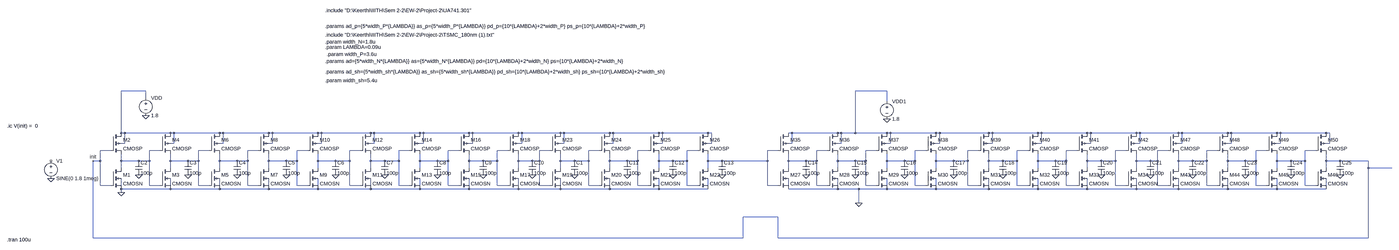
[diagram p0: schematic clock.asc, whole sheet]
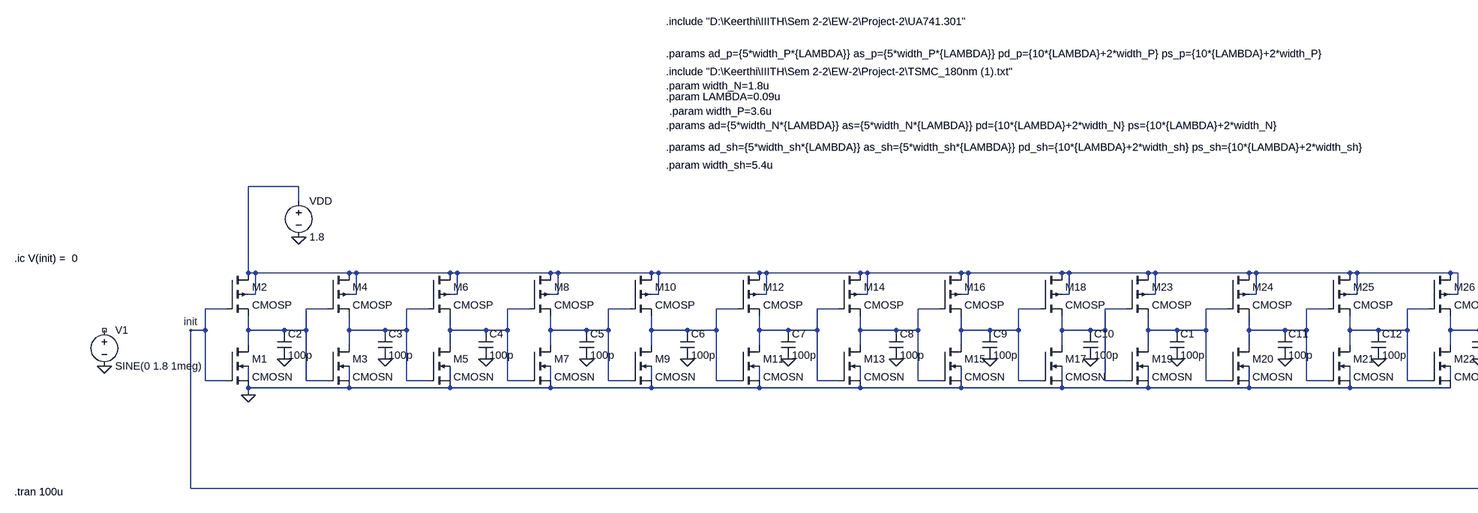
[diagram p1: schematic clock.asc, part, row 1 of 1, column 1 of 2]
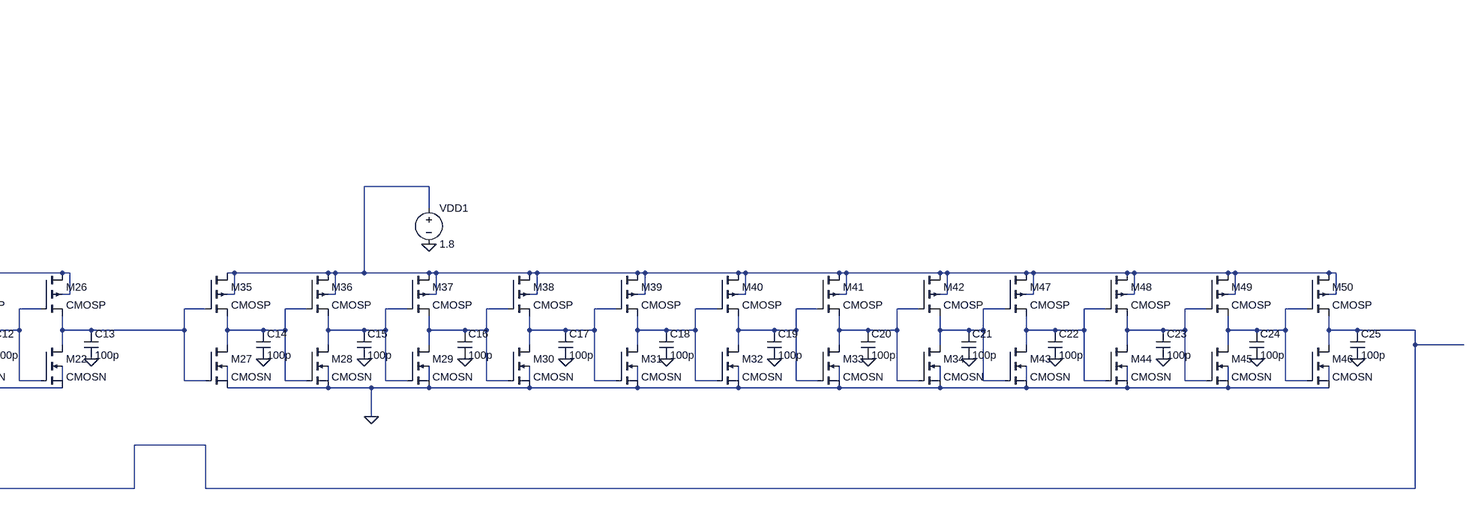
[diagram p2: schematic clock.asc, part, row 1 of 1, column 2 of 2]
clock.asc, the LTspice schematic file:
Version 4.1
SHEET 1 7152 696
WIRE 432 0 320 0
WIRE 3808 0 3664 0
WIRE 432 32 432 0
WIRE 3808 48 3808 0
WIRE 320 192 320 0
WIRE 336 192 320 192
WIRE 544 192 336 192
WIRE 560 192 544 192
WIRE 768 192 560 192
WIRE 784 192 768 192
WIRE 992 192 784 192
WIRE 1008 192 992 192
WIRE 1216 192 1008 192
WIRE 1232 192 1216 192
WIRE 1456 192 1232 192
WIRE 1472 192 1456 192
WIRE 1680 192 1472 192
WIRE 1696 192 1680 192
WIRE 1904 192 1696 192
WIRE 1920 192 1904 192
WIRE 2128 192 1920 192
WIRE 2144 192 2128 192
WIRE 2320 192 2144 192
WIRE 2336 192 2320 192
WIRE 2544 192 2336 192
WIRE 2560 192 2544 192
WIRE 2768 192 2560 192
WIRE 2784 192 2768 192
WIRE 2992 192 2784 192
WIRE 3008 192 2992 192
WIRE 3376 192 3360 192
WIRE 3584 192 3376 192
WIRE 3600 192 3584 192
WIRE 3664 192 3664 0
WIRE 3664 192 3600 192
WIRE 3808 192 3664 192
WIRE 3824 192 3808 192
WIRE 4032 192 3824 192
WIRE 4048 192 4032 192
WIRE 4272 192 4048 192
WIRE 4288 192 4272 192
WIRE 4496 192 4288 192
WIRE 4512 192 4496 192
WIRE 4720 192 4512 192
WIRE 4736 192 4720 192
WIRE 4944 192 4736 192
WIRE 4960 192 4944 192
WIRE 5136 192 4960 192
WIRE 5152 192 5136 192
WIRE 5360 192 5152 192
WIRE 5376 192 5360 192
WIRE 5584 192 5376 192
WIRE 5600 192 5584 192
WIRE 5808 192 5600 192
WIRE 5824 192 5808 192
WIRE 336 240 336 192
WIRE 336 240 320 240
WIRE 560 240 560 192
WIRE 560 240 544 240
WIRE 784 240 784 192
WIRE 784 240 768 240
WIRE 1008 240 1008 192
WIRE 1008 240 992 240
WIRE 1232 240 1232 192
WIRE 1232 240 1216 240
WIRE 1472 240 1472 192
WIRE 1472 240 1456 240
WIRE 1696 240 1696 192
WIRE 1696 240 1680 240
WIRE 1920 240 1920 192
WIRE 1920 240 1904 240
WIRE 2144 240 2144 192
WIRE 2144 240 2128 240
WIRE 2336 240 2336 192
WIRE 2336 240 2320 240
WIRE 2560 240 2560 192
WIRE 2560 240 2544 240
WIRE 2784 240 2784 192
WIRE 2784 240 2768 240
WIRE 3008 240 3008 192
WIRE 3008 240 2992 240
WIRE 3376 240 3376 192
WIRE 3376 240 3360 240
WIRE 3600 240 3600 192
WIRE 3600 240 3584 240
WIRE 3824 240 3824 192
WIRE 3824 240 3808 240
WIRE 4048 240 4048 192
WIRE 4048 240 4032 240
WIRE 4288 240 4288 192
WIRE 4288 240 4272 240
WIRE 4512 240 4512 192
WIRE 4512 240 4496 240
WIRE 4736 240 4736 192
WIRE 4736 240 4720 240
WIRE 4960 240 4960 192
WIRE 4960 240 4944 240
WIRE 5152 240 5152 192
WIRE 5152 240 5136 240
WIRE 5376 240 5376 192
WIRE 5376 240 5360 240
WIRE 5600 240 5600 192
WIRE 5600 240 5584 240
WIRE 5824 240 5824 192
WIRE 5824 240 5808 240
WIRE 272 272 224 272
WIRE 496 272 448 272
WIRE 720 272 672 272
WIRE 944 272 896 272
WIRE 1168 272 1120 272
WIRE 1408 272 1360 272
WIRE 1632 272 1584 272
WIRE 1856 272 1808 272
WIRE 2080 272 2032 272
WIRE 2272 272 2224 272
WIRE 2496 272 2448 272
WIRE 2720 272 2672 272
WIRE 2944 272 2896 272
WIRE 3312 272 3264 272
WIRE 3536 272 3488 272
WIRE 3760 272 3712 272
WIRE 3984 272 3936 272
WIRE 4224 272 4176 272
WIRE 4448 272 4400 272
WIRE 4672 272 4624 272
WIRE 4896 272 4848 272
WIRE 5088 272 5040 272
WIRE 5312 272 5264 272
WIRE 5536 272 5488 272
WIRE 5760 272 5712 272
WIRE 224 320 224 272
WIRE 224 320 192 320
WIRE 320 320 320 288
WIRE 400 320 320 320
WIRE 448 320 448 272
WIRE 448 320 400 320
WIRE 544 320 544 288
WIRE 624 320 544 320
WIRE 672 320 672 272
WIRE 672 320 624 320
WIRE 768 320 768 288
WIRE 848 320 768 320
WIRE 896 320 896 272
WIRE 896 320 848 320
WIRE 992 320 992 288
WIRE 1072 320 992 320
WIRE 1120 320 1120 272
WIRE 1120 320 1072 320
WIRE 1216 320 1216 288
WIRE 1296 320 1216 320
WIRE 1360 320 1360 272
WIRE 1360 320 1296 320
WIRE 1456 320 1456 288
WIRE 1520 320 1456 320
WIRE 1584 320 1584 272
WIRE 1584 320 1520 320
WIRE 1680 320 1680 288
WIRE 1760 320 1680 320
WIRE 1808 320 1808 272
WIRE 1808 320 1760 320
WIRE 1904 320 1904 288
WIRE 1968 320 1904 320
WIRE 2032 320 2032 272
WIRE 2032 320 1968 320
WIRE 2128 320 2128 288
WIRE 2192 320 2128 320
WIRE 2224 320 2224 272
WIRE 2224 320 2192 320
WIRE 2320 320 2320 288
WIRE 2384 320 2320 320
WIRE 2448 320 2448 272
WIRE 2448 320 2384 320
WIRE 2544 320 2544 288
WIRE 2624 320 2544 320
WIRE 2672 320 2672 272
WIRE 2672 320 2624 320
WIRE 2768 320 2768 288
WIRE 2832 320 2768 320
WIRE 2896 320 2896 272
WIRE 2896 320 2832 320
WIRE 2992 320 2992 288
WIRE 3056 320 2992 320
WIRE 3264 320 3264 272
WIRE 3264 320 3056 320
WIRE 3360 320 3360 288
WIRE 3440 320 3360 320
WIRE 3488 320 3488 272
WIRE 3488 320 3440 320
WIRE 3584 320 3584 288
WIRE 3664 320 3584 320
WIRE 3712 320 3712 272
WIRE 3712 320 3664 320
WIRE 3808 320 3808 288
WIRE 3888 320 3808 320
WIRE 3936 320 3936 272
WIRE 3936 320 3888 320
WIRE 4032 320 4032 288
WIRE 4112 320 4032 320
WIRE 4176 320 4176 272
WIRE 4176 320 4112 320
WIRE 4272 320 4272 288
WIRE 4336 320 4272 320
WIRE 4400 320 4400 272
WIRE 4400 320 4336 320
WIRE 4496 320 4496 288
WIRE 4576 320 4496 320
WIRE 4624 320 4624 272
WIRE 4624 320 4576 320
WIRE 4720 320 4720 288
WIRE 4784 320 4720 320
WIRE 4848 320 4848 272
WIRE 4848 320 4784 320
WIRE 4944 320 4944 288
WIRE 5008 320 4944 320
WIRE 5040 320 5040 272
WIRE 5040 320 5008 320
WIRE 5136 320 5136 288
WIRE 5200 320 5136 320
WIRE 5264 320 5264 272
WIRE 5264 320 5200 320
WIRE 5360 320 5360 288
WIRE 5440 320 5360 320
WIRE 5488 320 5488 272
WIRE 5488 320 5440 320
WIRE 5584 320 5584 288
WIRE 5648 320 5584 320
WIRE 5712 320 5712 272
WIRE 5712 320 5648 320
WIRE 5808 320 5808 288
WIRE 5872 320 5808 320
WIRE 6000 320 5872 320
WIRE 320 352 320 320
WIRE 544 352 544 320
WIRE 768 352 768 320
WIRE 992 352 992 320
WIRE 1216 352 1216 320
WIRE 1456 352 1456 320
WIRE 1680 352 1680 320
WIRE 1904 352 1904 320
WIRE 2128 352 2128 320
WIRE 2320 352 2320 320
WIRE 2544 352 2544 320
WIRE 2768 352 2768 320
WIRE 2992 352 2992 320
WIRE 3360 352 3360 320
WIRE 3584 352 3584 320
WIRE 3808 352 3808 320
WIRE 4032 352 4032 320
WIRE 4272 352 4272 320
WIRE 4496 352 4496 320
WIRE 4720 352 4720 320
WIRE 4944 352 4944 320
WIRE 5136 352 5136 320
WIRE 5360 352 5360 320
WIRE 5584 352 5584 320
WIRE 5808 352 5808 320
WIRE 6000 352 6000 320
WIRE 6208 352 6000 352
WIRE 224 432 224 320
WIRE 272 432 224 432
WIRE 320 432 320 400
WIRE 448 432 448 320
WIRE 496 432 448 432
WIRE 544 432 544 400
WIRE 672 432 672 320
WIRE 720 432 672 432
WIRE 768 432 768 400
WIRE 896 432 896 320
WIRE 944 432 896 432
WIRE 992 432 992 400
WIRE 1120 432 1120 320
WIRE 1168 432 1120 432
WIRE 1216 432 1216 400
WIRE 1360 432 1360 320
WIRE 1408 432 1360 432
WIRE 1456 432 1456 400
WIRE 1584 432 1584 320
WIRE 1632 432 1584 432
WIRE 1680 432 1680 400
WIRE 1808 432 1808 320
WIRE 1856 432 1808 432
WIRE 1904 432 1904 400
WIRE 2032 432 2032 320
WIRE 2080 432 2032 432
WIRE 2128 432 2128 400
WIRE 2224 432 2224 320
WIRE 2272 432 2224 432
WIRE 2320 432 2320 400
WIRE 2448 432 2448 320
WIRE 2496 432 2448 432
WIRE 2544 432 2544 400
WIRE 2672 432 2672 320
WIRE 2720 432 2672 432
WIRE 2768 432 2768 400
WIRE 2896 432 2896 320
WIRE 2944 432 2896 432
WIRE 2992 432 2992 400
WIRE 3264 432 3264 320
WIRE 3312 432 3264 432
WIRE 3360 432 3360 400
WIRE 3488 432 3488 320
WIRE 3536 432 3488 432
WIRE 3584 432 3584 400
WIRE 3712 432 3712 320
WIRE 3760 432 3712 432
WIRE 3808 432 3808 400
WIRE 3936 432 3936 320
WIRE 3984 432 3936 432
WIRE 4032 432 4032 400
WIRE 4176 432 4176 320
WIRE 4224 432 4176 432
WIRE 4272 432 4272 400
WIRE 4400 432 4400 320
WIRE 4448 432 4400 432
WIRE 4496 432 4496 400
WIRE 4624 432 4624 320
WIRE 4672 432 4624 432
WIRE 4720 432 4720 400
WIRE 4848 432 4848 320
WIRE 4896 432 4848 432
WIRE 4944 432 4944 400
WIRE 5040 432 5040 320
WIRE 5088 432 5040 432
WIRE 5136 432 5136 400
WIRE 5264 432 5264 320
WIRE 5312 432 5264 432
WIRE 5360 432 5360 400
WIRE 5488 432 5488 320
WIRE 5536 432 5488 432
WIRE 5584 432 5584 400
WIRE 5712 432 5712 320
WIRE 5760 432 5712 432
WIRE 5808 432 5808 400
WIRE 544 448 320 448
WIRE 768 448 544 448
WIRE 992 448 768 448
WIRE 1216 448 992 448
WIRE 1456 448 1216 448
WIRE 1680 448 1456 448
WIRE 1904 448 1680 448
WIRE 2128 448 1904 448
WIRE 2320 448 2128 448
WIRE 2544 448 2320 448
WIRE 2768 448 2544 448
WIRE 2992 448 2768 448
WIRE 3584 448 3360 448
WIRE 3680 448 3584 448
WIRE 3808 448 3680 448
WIRE 4032 448 3808 448
WIRE 4272 448 4032 448
WIRE 4496 448 4272 448
WIRE 4720 448 4496 448
WIRE 4944 448 4720 448
WIRE 5136 448 4944 448
WIRE 5360 448 5136 448
WIRE 5584 448 5360 448
WIRE 5808 448 5584 448
WIRE 320 464 320 448
WIRE 3680 512 3680 448
WIRE 3312 576 3152 576
WIRE 192 672 192 320
WIRE 3152 672 3152 576
WIRE 3152 672 192 672
WIRE 3312 672 3312 576
WIRE 6000 672 6000 352
WIRE 6000 672 3312 672
FLAG 432 112 0
FLAG 0 400 0
FLAG 192 320 init
FLAG 320 464 0
FLAG 2192 384 0
FLAG 1968 384 0
FLAG 1760 384 0
FLAG 1520 384 0
FLAG 1296 384 0
FLAG 1072 384 0
FLAG 848 384 0
FLAG 624 384 0
FLAG 400 384 0
FLAG 3056 384 0
FLAG 2832 384 0
FLAG 2624 384 0
FLAG 2384 384 0
FLAG 5008 384 0
FLAG 4784 384 0
FLAG 4576 384 0
FLAG 4336 384 0
FLAG 4112 384 0
FLAG 3888 384 0
FLAG 3664 384 0
FLAG 3440 384 0
FLAG 5872 384 0
FLAG 5648 384 0
FLAG 5440 384 0
FLAG 5200 384 0
FLAG 3808 128 0
FLAG 3680 512 0
SYMBOL nmos4 272 352 R0
SYMATTR InstName M1
SYMATTR Value CMOSN
SYMATTR Value2 l={2*LAMBDA} w={width_N} ad={ad} as={as} pd={pd} ps={ps}
SYMBOL pmos4 272 192 R0
SYMATTR InstName M2
SYMATTR Value CMOSP
SYMATTR Value2 l={2*LAMBDA} w={width_P} ad={ad_p} as={as_p} pd={pd_p} ps={ps_p}
SYMBOL voltage 0 304 R0
WINDOW 123 0 0 Left 0
WINDOW 39 0 0 Left 0
SYMATTR InstName V1
SYMATTR Value SINE(0 1.8 1meg)
SYMBOL voltage 432 16 R0
SYMATTR InstName VDD
SYMATTR Value 1.8
SYMBOL nmos4 496 352 R0
SYMATTR InstName M3
SYMATTR Value CMOSN
SYMATTR Value2 l={2*LAMBDA} w={width_N} ad={ad} as={as} pd={pd} ps={ps}
SYMBOL nmos4 720 352 R0
SYMATTR InstName M5
SYMATTR Value CMOSN
SYMATTR Value2 l={2*LAMBDA} w={width_N} ad={ad} as={as} pd={pd} ps={ps}
SYMBOL nmos4 944 352 R0
SYMATTR InstName M7
SYMATTR Value CMOSN
SYMATTR Value2 l={2*LAMBDA} w={width_N} ad={ad} as={as} pd={pd} ps={ps}
SYMBOL nmos4 1168 352 R0
SYMATTR InstName M9
SYMATTR Value CMOSN
SYMATTR Value2 l={2*LAMBDA} w={width_N} ad={ad} as={as} pd={pd} ps={ps}
SYMBOL nmos4 1408 352 R0
SYMATTR InstName M11
SYMATTR Value CMOSN
SYMATTR Value2 l={2*LAMBDA} w={width_N} ad={ad} as={as} pd={pd} ps={ps}
SYMBOL nmos4 1632 352 R0
SYMATTR InstName M13
SYMATTR Value CMOSN
SYMATTR Value2 l={2*LAMBDA} w={width_N} ad={ad} as={as} pd={pd} ps={ps}
SYMBOL nmos4 1856 352 R0
SYMATTR InstName M15
SYMATTR Value CMOSN
SYMATTR Value2 l={2*LAMBDA} w={width_N} ad={ad} as={as} pd={pd} ps={ps}
SYMBOL nmos4 2080 352 R0
SYMATTR InstName M17
SYMATTR Value CMOSN
SYMATTR Value2 l={2*LAMBDA} w={width_N} ad={ad} as={as} pd={pd} ps={ps}
SYMBOL cap 384 320 R0
SYMATTR InstName C2
SYMATTR Value 100p
SYMBOL cap 608 320 R0
SYMATTR InstName C3
SYMATTR Value 100p
SYMBOL cap 832 320 R0
SYMATTR InstName C4
SYMATTR Value 100p
SYMBOL cap 1056 320 R0
SYMATTR InstName C5
SYMATTR Value 100p
SYMBOL cap 1280 320 R0
SYMATTR InstName C6
SYMATTR Value 100p
SYMBOL cap 1504 320 R0
SYMATTR InstName C7
SYMATTR Value 100p
SYMBOL cap 1744 320 R0
SYMATTR InstName C8
SYMATTR Value 100p
SYMBOL cap 1952 320 R0
SYMATTR InstName C9
SYMATTR Value 100p
SYMBOL cap 2176 320 R0
SYMATTR InstName C10
SYMATTR Value 100p
SYMBOL pmos4 496 192 R0
SYMATTR InstName M4
SYMATTR Value CMOSP
SYMATTR Value2 l={2*LAMBDA} w={width_P} ad={ad_p} as={as_p} pd={pd_p} ps={ps_p}
SYMBOL pmos4 720 192 R0
SYMATTR InstName M6
SYMATTR Value CMOSP
SYMATTR Value2 l={2*LAMBDA} w={width_P} ad={ad_p} as={as_p} pd={pd_p} ps={ps_p}
SYMBOL pmos4 944 192 R0
SYMATTR InstName M8
SYMATTR Value CMOSP
SYMATTR Value2 l={2*LAMBDA} w={width_P} ad={ad_p} as={as_p} pd={pd_p} ps={ps_p}
SYMBOL pmos4 1168 192 R0
SYMATTR InstName M10
SYMATTR Value CMOSP
SYMATTR Value2 l={2*LAMBDA} w={width_P} ad={ad_p} as={as_p} pd={pd_p} ps={ps_p}
SYMBOL pmos4 1408 192 R0
SYMATTR InstName M12
SYMATTR Value CMOSP
SYMATTR Value2 l={2*LAMBDA} w={width_P} ad={ad_p} as={as_p} pd={pd_p} ps={ps_p}
SYMBOL pmos4 1632 192 R0
SYMATTR InstName M14
SYMATTR Value CMOSP
SYMATTR Value2 l={2*LAMBDA} w={width_P} ad={ad_p} as={as_p} pd={pd_p} ps={ps_p}
SYMBOL pmos4 1856 192 R0
SYMATTR InstName M16
SYMATTR Value CMOSP
SYMATTR Value2 l={2*LAMBDA} w={width_P} ad={ad_p} as={as_p} pd={pd_p} ps={ps_p}
SYMBOL pmos4 2080 192 R0
SYMATTR InstName M18
SYMATTR Value CMOSP
SYMATTR Value2 l={2*LAMBDA} w={width_P} ad={ad_p} as={as_p} pd={pd_p} ps={ps_p}
SYMBOL nmos4 2272 352 R0
SYMATTR InstName M19
SYMATTR Value CMOSN
SYMATTR Value2 l={2*LAMBDA} w={width_N} ad={ad} as={as} pd={pd} ps={ps}
SYMBOL nmos4 2496 352 R0
SYMATTR InstName M20
SYMATTR Value CMOSN
SYMATTR Value2 l={2*LAMBDA} w={width_N} ad={ad} as={as} pd={pd} ps={ps}
SYMBOL nmos4 2720 352 R0
SYMATTR InstName M21
SYMATTR Value CMOSN
SYMATTR Value2 l={2*LAMBDA} w={width_N} ad={ad} as={as} pd={pd} ps={ps}
SYMBOL nmos4 2944 352 R0
SYMATTR InstName M22
SYMATTR Value CMOSN
SYMATTR Value2 l={2*LAMBDA} w={width_N} ad={ad} as={as} pd={pd} ps={ps}
SYMBOL cap 2368 320 R0
SYMATTR InstName C1
SYMATTR Value 100p
SYMBOL cap 2608 320 R0
SYMATTR InstName C11
SYMATTR Value 100p
SYMBOL cap 2816 320 R0
SYMATTR InstName C12
SYMATTR Value 100p
SYMBOL cap 3040 320 R0
SYMATTR InstName C13
SYMATTR Value 100p
SYMBOL pmos4 2272 192 R0
SYMATTR InstName M23
SYMATTR Value CMOSP
SYMATTR Value2 l={2*LAMBDA} w={width_P} ad={ad_p} as={as_p} pd={pd_p} ps={ps_p}
SYMBOL pmos4 2496 192 R0
SYMATTR InstName M24
SYMATTR Value CMOSP
SYMATTR Value2 l={2*LAMBDA} w={width_P} ad={ad_p} as={as_p} pd={pd_p} ps={ps_p}
SYMBOL pmos4 2720 192 R0
SYMATTR InstName M25
SYMATTR Value CMOSP
SYMATTR Value2 l={2*LAMBDA} w={width_P} ad={ad_p} as={as_p} pd={pd_p} ps={ps_p}
SYMBOL pmos4 2944 192 R0
SYMATTR InstName M26
SYMATTR Value CMOSP
SYMATTR Value2 l={2*LAMBDA} w={width_P} ad={ad_p} as={as_p} pd={pd_p} ps={ps_p}
SYMBOL nmos4 3312 352 R0
SYMATTR InstName M27
SYMATTR Value CMOSN
SYMATTR Value2 l={2*LAMBDA} w={width_N} ad={ad} as={as} pd={pd} ps={ps}
SYMBOL nmos4 3536 352 R0
SYMATTR InstName M28
SYMATTR Value CMOSN
SYMATTR Value2 l={2*LAMBDA} w={width_N} ad={ad} as={as} pd={pd} ps={ps}
SYMBOL nmos4 3760 352 R0
SYMATTR InstName M29
SYMATTR Value CMOSN
SYMATTR Value2 l={2*LAMBDA} w={width_N} ad={ad} as={as} pd={pd} ps={ps}
SYMBOL nmos4 3984 352 R0
SYMATTR InstName M30
SYMATTR Value CMOSN
SYMATTR Value2 l={2*LAMBDA} w={width_N} ad={ad} as={as} pd={pd} ps={ps}
SYMBOL nmos4 4224 352 R0
SYMATTR InstName M31
SYMATTR Value CMOSN
SYMATTR Value2 l={2*LAMBDA} w={width_N} ad={ad} as={as} pd={pd} ps={ps}
SYMBOL nmos4 4448 352 R0
SYMATTR InstName M32
SYMATTR Value CMOSN
SYMATTR Value2 l={2*LAMBDA} w={width_N} ad={ad} as={as} pd={pd} ps={ps}
SYMBOL nmos4 4672 352 R0
SYMATTR InstName M33
SYMATTR Value CMOSN
SYMATTR Value2 l={2*LAMBDA} w={width_N} ad={ad} as={as} pd={pd} ps={ps}
SYMBOL nmos4 4896 352 R0
SYMATTR InstName M34
SYMATTR Value CMOSN
SYMATTR Value2 l={2*LAMBDA} w={width_N} ad={ad} as={as} pd={pd} ps={ps}
SYMBOL cap 3424 320 R0
SYMATTR InstName C14
SYMATTR Value 100p
SYMBOL cap 3648 320 R0
SYMATTR InstName C15
SYMATTR Value 100p
SYMBOL cap 3872 320 R0
SYMATTR InstName C16
SYMATTR Value 100p
SYMBOL cap 4096 320 R0
SYMATTR InstName C17
SYMATTR Value 100p
SYMBOL cap 4320 320 R0
SYMATTR InstName C18
SYMATTR Value 100p
SYMBOL cap 4560 320 R0
SYMATTR InstName C19
SYMATTR Value 100p
SYMBOL cap 4768 320 R0
SYMATTR InstName C20
SYMATTR Value 100p
SYMBOL cap 4992 320 R0
SYMATTR InstName C21
SYMATTR Value 100p
SYMBOL pmos4 3312 192 R0
SYMATTR InstName M35
SYMATTR Value CMOSP
SYMATTR Value2 l={2*LAMBDA} w={width_P} ad={ad_p} as={as_p} pd={pd_p} ps={ps_p}
SYMBOL pmos4 3536 192 R0
SYMATTR InstName M36
SYMATTR Value CMOSP
SYMATTR Value2 l={2*LAMBDA} w={width_P} ad={ad_p} as={as_p} pd={pd_p} ps={ps_p}
SYMBOL pmos4 3760 192 R0
SYMATTR InstName M37
SYMATTR Value CMOSP
SYMATTR Value2 l={2*LAMBDA} w={width_P} ad={ad_p} as={as_p} pd={pd_p} ps={ps_p}
SYMBOL pmos4 3984 192 R0
SYMATTR InstName M38
SYMATTR Value CMOSP
SYMATTR Value2 l={2*LAMBDA} w={width_P} ad={ad_p} as={as_p} pd={pd_p} ps={ps_p}
SYMBOL pmos4 4224 192 R0
SYMATTR InstName M39
SYMATTR Value CMOSP
SYMATTR Value2 l={2*LAMBDA} w={width_P} ad={ad_p} as={as_p} pd={pd_p} ps={ps_p}
SYMBOL pmos4 4448 192 R0
SYMATTR InstName M40
SYMATTR Value CMOSP
SYMATTR Value2 l={2*LAMBDA} w={width_P} ad={ad_p} as={as_p} pd={pd_p} ps={ps_p}
SYMBOL pmos4 4672 192 R0
SYMATTR InstName M41
SYMATTR Value CMOSP
SYMATTR Value2 l={2*LAMBDA} w={width_P} ad={ad_p} as={as_p} pd={pd_p} ps={ps_p}
SYMBOL pmos4 4896 192 R0
SYMATTR InstName M42
SYMATTR Value CMOSP
SYMATTR Value2 l={2*LAMBDA} w={width_P} ad={ad_p} as={as_p} pd={pd_p} ps={ps_p}
SYMBOL nmos4 5088 352 R0
SYMATTR InstName M43
SYMATTR Value CMOSN
SYMATTR Value2 l={2*LAMBDA} w={width_N} ad={ad} as={as} pd={pd} ps={ps}
SYMBOL nmos4 5312 352 R0
SYMATTR InstName M44
SYMATTR Value CMOSN
SYMATTR Value2 l={2*LAMBDA} w={width_N} ad={ad} as={as} pd={pd} ps={ps}
SYMBOL nmos4 5536 352 R0
SYMATTR InstName M45
SYMATTR Value CMOSN
SYMATTR Value2 l={2*LAMBDA} w={width_N} ad={ad} as={as} pd={pd} ps={ps}
SYMBOL nmos4 5760 352 R0
SYMATTR InstName M46
SYMATTR Value CMOSN
SYMATTR Value2 l={2*LAMBDA} w={width_N} ad={ad} as={as} pd={pd} ps={ps}
SYMBOL cap 5184 320 R0
SYMATTR InstName C22
SYMATTR Value 100p
SYMBOL cap 5424 320 R0
SYMATTR InstName C23
SYMATTR Value 100p
SYMBOL cap 5632 320 R0
SYMATTR InstName C24
SYMATTR Value 100p
SYMBOL cap 5856 320 R0
SYMATTR InstName C25
SYMATTR Value 100p
SYMBOL pmos4 5088 192 R0
SYMATTR InstName M47
SYMATTR Value CMOSP
SYMATTR Value2 l={2*LAMBDA} w={width_P} ad={ad_p} as={as_p} pd={pd_p} ps={ps_p}
SYMBOL pmos4 5312 192 R0
SYMATTR InstName M48
SYMATTR Value CMOSP
SYMATTR Value2 l={2*LAMBDA} w={width_P} ad={ad_p} as={as_p} pd={pd_p} ps={ps_p}
SYMBOL pmos4 5536 192 R0
SYMATTR InstName M49
SYMATTR Value CMOSP
SYMATTR Value2 l={2*LAMBDA} w={width_P} ad={ad_p} as={as_p} pd={pd_p} ps={ps_p}
SYMBOL pmos4 5760 192 R0
SYMATTR InstName M50
SYMATTR Value CMOSP
SYMATTR Value2 l={2*LAMBDA} w={width_P} ad={ad_p} as={as_p} pd={pd_p} ps={ps_p}
SYMBOL voltage 3808 32 R0
SYMATTR InstName VDD1
SYMATTR Value 1.8
TEXT 1248 -256 Left 2 !.include "D:\\Keerthi\\IIITH\\Sem 2-2\\EW-2\\Project-2\\TSMC_180nm (1).txt"
TEXT 1248 -224 Left 2 !.param width_N=1.8u
TEXT 1248 -200 Left 2 !.param LAMBDA=0.09u
TEXT -200 160 Left 2 !.ic V(init) =  0
TEXT -200 680 Left 2 !.tran 100u
TEXT 1248 -136 Left 2 !.params ad={5*width_N*{LAMBDA}} as={5*width_N*{LAMBDA}} pd={10*{LAMBDA}+2*width_N} ps={10*{LAMBDA}+2*width_N}
TEXT 1256 -168 Left 2 !.param width_P=3.6u
TEXT 1248 -296 Left 2 !.params ad_p={5*width_P*{LAMBDA}} as_p={5*width_P*{LAMBDA}} pd_p={10*{LAMBDA}+2*width_P} ps_p={10*{LAMBDA}+2*width_P}
TEXT 1248 -368 Left 2 !.include "D:\\Keerthi\\IIITH\\Sem 2-2\\EW-2\\Project-2\\UA741.301"
TEXT 1248 -88 Left 2 !.params ad_sh={5*width_sh*{LAMBDA}} as_sh={5*width_sh*{LAMBDA}} pd_sh={10*{LAMBDA}+2*width_sh} ps_sh={10*{LAMBDA}+2*width_sh}
TEXT 1248 -48 Left 2 !.param width_sh=5.4u

The netlist it stands for:
* clock.asc
M1 N003 init 0 N027 CMOSN l={2*LAMBDA} w={width_N} ad={ad} as={as} pd={pd} ps={ps}
M2 N001 init N003 N001 CMOSP l={2*LAMBDA} w={width_P} ad={ad_p} as={as_p} pd={pd_p} ps={ps_p}
V1 NC_01 0 SINE(0 1.8 1meg)
VDD N001 0 1.8
M3 N004 N003 0 N028 CMOSN l={2*LAMBDA} w={width_N} ad={ad} as={as} pd={pd} ps={ps}
M5 N005 N004 0 N029 CMOSN l={2*LAMBDA} w={width_N} ad={ad} as={as} pd={pd} ps={ps}
M7 N006 N005 0 N030 CMOSN l={2*LAMBDA} w={width_N} ad={ad} as={as} pd={pd} ps={ps}
M9 N007 N006 0 N031 CMOSN l={2*LAMBDA} w={width_N} ad={ad} as={as} pd={pd} ps={ps}
M11 N008 N007 0 N032 CMOSN l={2*LAMBDA} w={width_N} ad={ad} as={as} pd={pd} ps={ps}
M13 N009 N008 0 N033 CMOSN l={2*LAMBDA} w={width_N} ad={ad} as={as} pd={pd} ps={ps}
M15 N010 N009 0 N034 CMOSN l={2*LAMBDA} w={width_N} ad={ad} as={as} pd={pd} ps={ps}
M17 N011 N010 0 N035 CMOSN l={2*LAMBDA} w={width_N} ad={ad} as={as} pd={pd} ps={ps}
C2 N003 0 100p
C3 N004 0 100p
C4 N005 0 100p
C5 N006 0 100p
C6 N007 0 100p
C7 N008 0 100p
C8 N009 0 100p
C9 N010 0 100p
C10 N011 0 100p
M4 N001 N003 N004 N001 CMOSP l={2*LAMBDA} w={width_P} ad={ad_p} as={as_p} pd={pd_p} ps={ps_p}
M6 N001 N004 N005 N001 CMOSP l={2*LAMBDA} w={width_P} ad={ad_p} as={as_p} pd={pd_p} ps={ps_p}
M8 N001 N005 N006 N001 CMOSP l={2*LAMBDA} w={width_P} ad={ad_p} as={as_p} pd={pd_p} ps={ps_p}
M10 N001 N006 N007 N001 CMOSP l={2*LAMBDA} w={width_P} ad={ad_p} as={as_p} pd={pd_p} ps={ps_p}
M12 N001 N007 N008 N001 CMOSP l={2*LAMBDA} w={width_P} ad={ad_p} as={as_p} pd={pd_p} ps={ps_p}
M14 N001 N008 N009 N001 CMOSP l={2*LAMBDA} w={width_P} ad={ad_p} as={as_p} pd={pd_p} ps={ps_p}
M16 N001 N009 N010 N001 CMOSP l={2*LAMBDA} w={width_P} ad={ad_p} as={as_p} pd={pd_p} ps={ps_p}
M18 N001 N010 N011 N001 CMOSP l={2*LAMBDA} w={width_P} ad={ad_p} as={as_p} pd={pd_p} ps={ps_p}
M19 N012 N011 0 N036 CMOSN l={2*LAMBDA} w={width_N} ad={ad} as={as} pd={pd} ps={ps}
M20 N013 N012 0 N037 CMOSN l={2*LAMBDA} w={width_N} ad={ad} as={as} pd={pd} ps={ps}
M21 N014 N013 0 N038 CMOSN l={2*LAMBDA} w={width_N} ad={ad} as={as} pd={pd} ps={ps}
M22 N015 N014 0 N039 CMOSN l={2*LAMBDA} w={width_N} ad={ad} as={as} pd={pd} ps={ps}
C1 N012 0 100p
C11 N013 0 100p
C12 N014 0 100p
C13 N015 0 100p
M23 N001 N011 N012 N001 CMOSP l={2*LAMBDA} w={width_P} ad={ad_p} as={as_p} pd={pd_p} ps={ps_p}
M24 N001 N012 N013 N001 CMOSP l={2*LAMBDA} w={width_P} ad={ad_p} as={as_p} pd={pd_p} ps={ps_p}
M25 N001 N013 N014 N001 CMOSP l={2*LAMBDA} w={width_P} ad={ad_p} as={as_p} pd={pd_p} ps={ps_p}
M26 N001 N014 N015 N001 CMOSP l={2*LAMBDA} w={width_P} ad={ad_p} as={as_p} pd={pd_p} ps={ps_p}
M27 N016 N015 0 N040 CMOSN l={2*LAMBDA} w={width_N} ad={ad} as={as} pd={pd} ps={ps}
M28 N017 N016 0 N041 CMOSN l={2*LAMBDA} w={width_N} ad={ad} as={as} pd={pd} ps={ps}
M29 N018 N017 0 N042 CMOSN l={2*LAMBDA} w={width_N} ad={ad} as={as} pd={pd} ps={ps}
M30 N019 N018 0 N043 CMOSN l={2*LAMBDA} w={width_N} ad={ad} as={as} pd={pd} ps={ps}
M31 N020 N019 0 N044 CMOSN l={2*LAMBDA} w={width_N} ad={ad} as={as} pd={pd} ps={ps}
M32 N021 N020 0 N045 CMOSN l={2*LAMBDA} w={width_N} ad={ad} as={as} pd={pd} ps={ps}
M33 N022 N021 0 N046 CMOSN l={2*LAMBDA} w={width_N} ad={ad} as={as} pd={pd} ps={ps}
M34 N023 N022 0 N047 CMOSN l={2*LAMBDA} w={width_N} ad={ad} as={as} pd={pd} ps={ps}
C14 N016 0 100p
C15 N017 0 100p
C16 N018 0 100p
C17 N019 0 100p
C18 N020 0 100p
C19 N021 0 100p
C20 N022 0 100p
C21 N023 0 100p
M35 N002 N015 N016 N002 CMOSP l={2*LAMBDA} w={width_P} ad={ad_p} as={as_p} pd={pd_p} ps={ps_p}
M36 N002 N016 N017 N002 CMOSP l={2*LAMBDA} w={width_P} ad={ad_p} as={as_p} pd={pd_p} ps={ps_p}
M37 N002 N017 N018 N002 CMOSP l={2*LAMBDA} w={width_P} ad={ad_p} as={as_p} pd={pd_p} ps={ps_p}
M38 N002 N018 N019 N002 CMOSP l={2*LAMBDA} w={width_P} ad={ad_p} as={as_p} pd={pd_p} ps={ps_p}
M39 N002 N019 N020 N002 CMOSP l={2*LAMBDA} w={width_P} ad={ad_p} as={as_p} pd={pd_p} ps={ps_p}
M40 N002 N020 N021 N002 CMOSP l={2*LAMBDA} w={width_P} ad={ad_p} as={as_p} pd={pd_p} ps={ps_p}
M41 N002 N021 N022 N002 CMOSP l={2*LAMBDA} w={width_P} ad={ad_p} as={as_p} pd={pd_p} ps={ps_p}
M42 N002 N022 N023 N002 CMOSP l={2*LAMBDA} w={width_P} ad={ad_p} as={as_p} pd={pd_p} ps={ps_p}
M43 N024 N023 0 N048 CMOSN l={2*LAMBDA} w={width_N} ad={ad} as={as} pd={pd} ps={ps}
M44 N025 N024 0 N049 CMOSN l={2*LAMBDA} w={width_N} ad={ad} as={as} pd={pd} ps={ps}
M45 N026 N025 0 N050 CMOSN l={2*LAMBDA} w={width_N} ad={ad} as={as} pd={pd} ps={ps}
M46 init N026 0 N051 CMOSN l={2*LAMBDA} w={width_N} ad={ad} as={as} pd={pd} ps={ps}
C22 N024 0 100p
C23 N025 0 100p
C24 N026 0 100p
C25 init 0 100p
M47 N002 N023 N024 N002 CMOSP l={2*LAMBDA} w={width_P} ad={ad_p} as={as_p} pd={pd_p} ps={ps_p}
M48 N002 N024 N025 N002 CMOSP l={2*LAMBDA} w={width_P} ad={ad_p} as={as_p} pd={pd_p} ps={ps_p}
M49 N002 N025 N026 N002 CMOSP l={2*LAMBDA} w={width_P} ad={ad_p} as={as_p} pd={pd_p} ps={ps_p}
M50 N002 N026 init N002 CMOSP l={2*LAMBDA} w={width_P} ad={ad_p} as={as_p} pd={pd_p} ps={ps_p}
VDD1 N002 0 1.8
.model NMOS NMOS
.model PMOS PMOS
.lib standard.mos
.include "D:\Keerthi\IIITH\Sem 2-2\EW-2\Project-2\TSMC_180nm (1).txt"
.param width_N=1.8u
.param LAMBDA=0.09u
.ic V(init) =  0
.tran 100u
.params ad={5*width_N*{LAMBDA}} as={5*width_N*{LAMBDA}} pd={10*{LAMBDA}+2*width_N} ps={10*{LAMBDA}+2*width_N}
.param width_P=3.6u
.params ad_p={5*width_P*{LAMBDA}} as_p={5*width_P*{LAMBDA}} pd_p={10*{LAMBDA}+2*width_P} ps_p={10*{LAMBDA}+2*width_P}
.include "D:\Keerthi\IIITH\Sem 2-2\EW-2\Project-2\UA741.301"
.params ad_sh={5*width_sh*{LAMBDA}} as_sh={5*width_sh*{LAMBDA}} pd_sh={10*{LAMBDA}+2*width_sh} ps_sh={10*{LAMBDA}+2*width_sh}
.param width_sh=5.4u
.backanno
.end